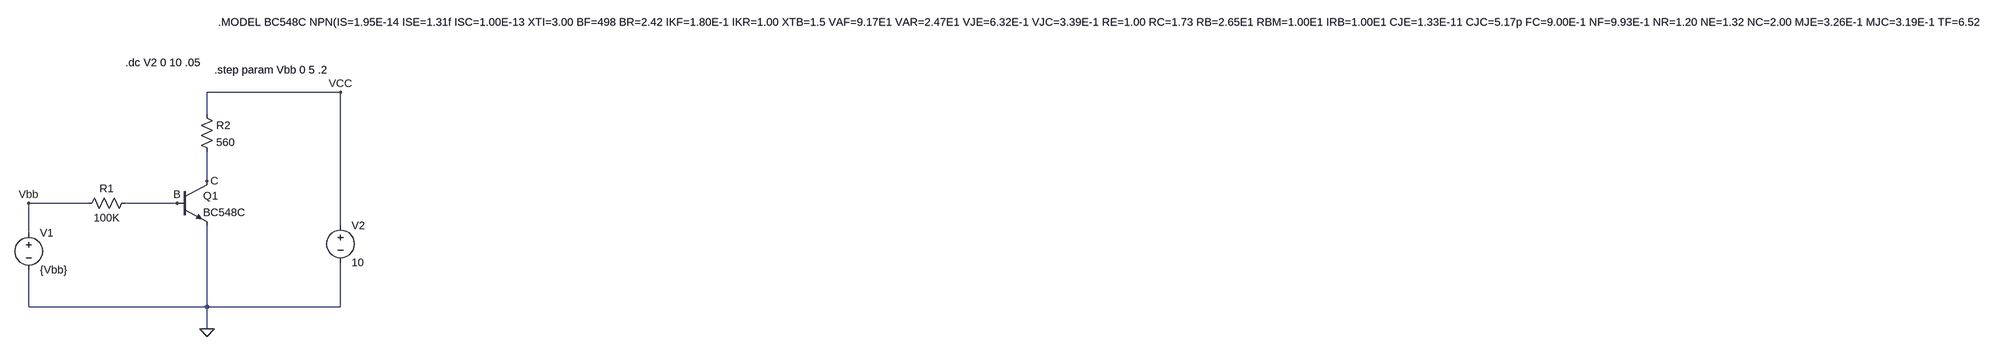
[diagram p0: schematic Curvas_Caracteristicas.asc]
Curvas_Caracteristicas.asc, the LTspice schematic file:
Version 4.1
SHEET 1 5692 680
WIRE 736 -160 448 -160
WIRE 448 -112 448 -160
WIRE 448 32 448 -32
WIRE 192 80 64 80
WIRE 384 80 272 80
WIRE 736 128 736 -160
WIRE 64 144 64 80
WIRE 64 304 64 224
WIRE 448 304 448 128
WIRE 448 304 64 304
WIRE 736 304 736 208
WIRE 736 304 448 304
WIRE 448 352 448 304
FLAG 448 352 0
FLAG 64 80 Vbb
FLAG 384 80 B
FLAG 448 32 C
FLAG 736 -160 VCC
SYMBOL voltage 64 128 R0
SYMATTR InstName V1
SYMATTR Value {Vbb}
SYMBOL res 288 64 R90
WINDOW 0 0 56 VBottom 2
WINDOW 3 32 56 VTop 2
SYMATTR InstName R1
SYMATTR Value 100K
SYMBOL res 432 -128 R0
SYMATTR InstName R2
SYMATTR Value 560
SYMBOL voltage 736 112 R0
SYMATTR InstName V2
SYMATTR Value 10
SYMBOL npn 384 32 R0
SYMATTR InstName Q1
SYMATTR Value BC548C
TEXT 464 -208 Left 2 !.step param Vbb 0 5 .2
TEXT 472 -312 Left 2 !.MODEL BC548C NPN(IS=1.95E-14 ISE=1.31f ISC=1.00E-13 XTI=3.00 BF=498 BR=2.42 IKF=1.80E-1 IKR=1.00 XTB=1.5 VAF=9.17E1 VAR=2.47E1 VJE=6.32E-1 VJC=3.39E-1 RE=1.00 RC=1.73 RB=2.65E1 RBM=1.00E1 IRB=1.00E1 CJE=1.33E-11 CJC=5.17p FC=9.00E-1 NF=9.93E-1 NR=1.20 NE=1.32 NC=2.00 MJE=3.26E-1 MJC=3.19E-1 TF=6.52E-10 TR=0 ITF=1.03 VTF=1.65 XTF=1.00E2 EG=1.11 VCEO=30 ICRATING=100m MFG=PHILIPS)
TEXT 272 -224 Left 2 !.dc V2 0 10 .05

The netlist it stands for:
* Curvas_Caracteristicas.asc
V1 Vbb 0 {Vbb}
R1 B Vbb 100K
R2 VCC C 560
V2 VCC 0 10
Q1 C B 0 0 BC548C
.model NPN NPN
.model PNP PNP
.lib standard.bjt
.step param Vbb 0 5 .2
.MODEL BC548C NPN(IS=1.95E-14 ISE=1.31f ISC=1.00E-13 XTI=3.00 BF=498 BR=2.42 IKF=1.80E-1 IKR=1.00 XTB=1.5 VAF=9.17E1 VAR=2.47E1 VJE=6.32E-1 VJC=3.39E-1 RE=1.00 RC=1.73 RB=2.65E1 RBM=1.00E1 IRB=1.00E1 CJE=1.33E-11 CJC=5.17p FC=9.00E-1 NF=9.93E-1 NR=1.20 NE=1.32 NC=2.00 MJE=3.26E-1 MJC=3.19E-1 TF=6.52E-10 TR=0 ITF=1.03 VTF=1.65 XTF=1.00E2 EG=1.11 VCEO=30 ICRATING=100m MFG=PHILIPS)
.dc V2 0 10 .05
.backanno
.end